# Altium schematic sheet Main.SchDoc
size 431 x 279 mm; Organization: ORGANIZATION; Address1: ADDRESS 1; Address2: ADDRESS 2; Address3: ADDRESS 3; Address4: ADDRESS 4; Revision: -; SheetNumber: 1; SheetTotal: 8; ENG_APP_DATE: --/--/--; DSN_APP_DATE: --/--/--; CHK_APP_DATE: --/--/--
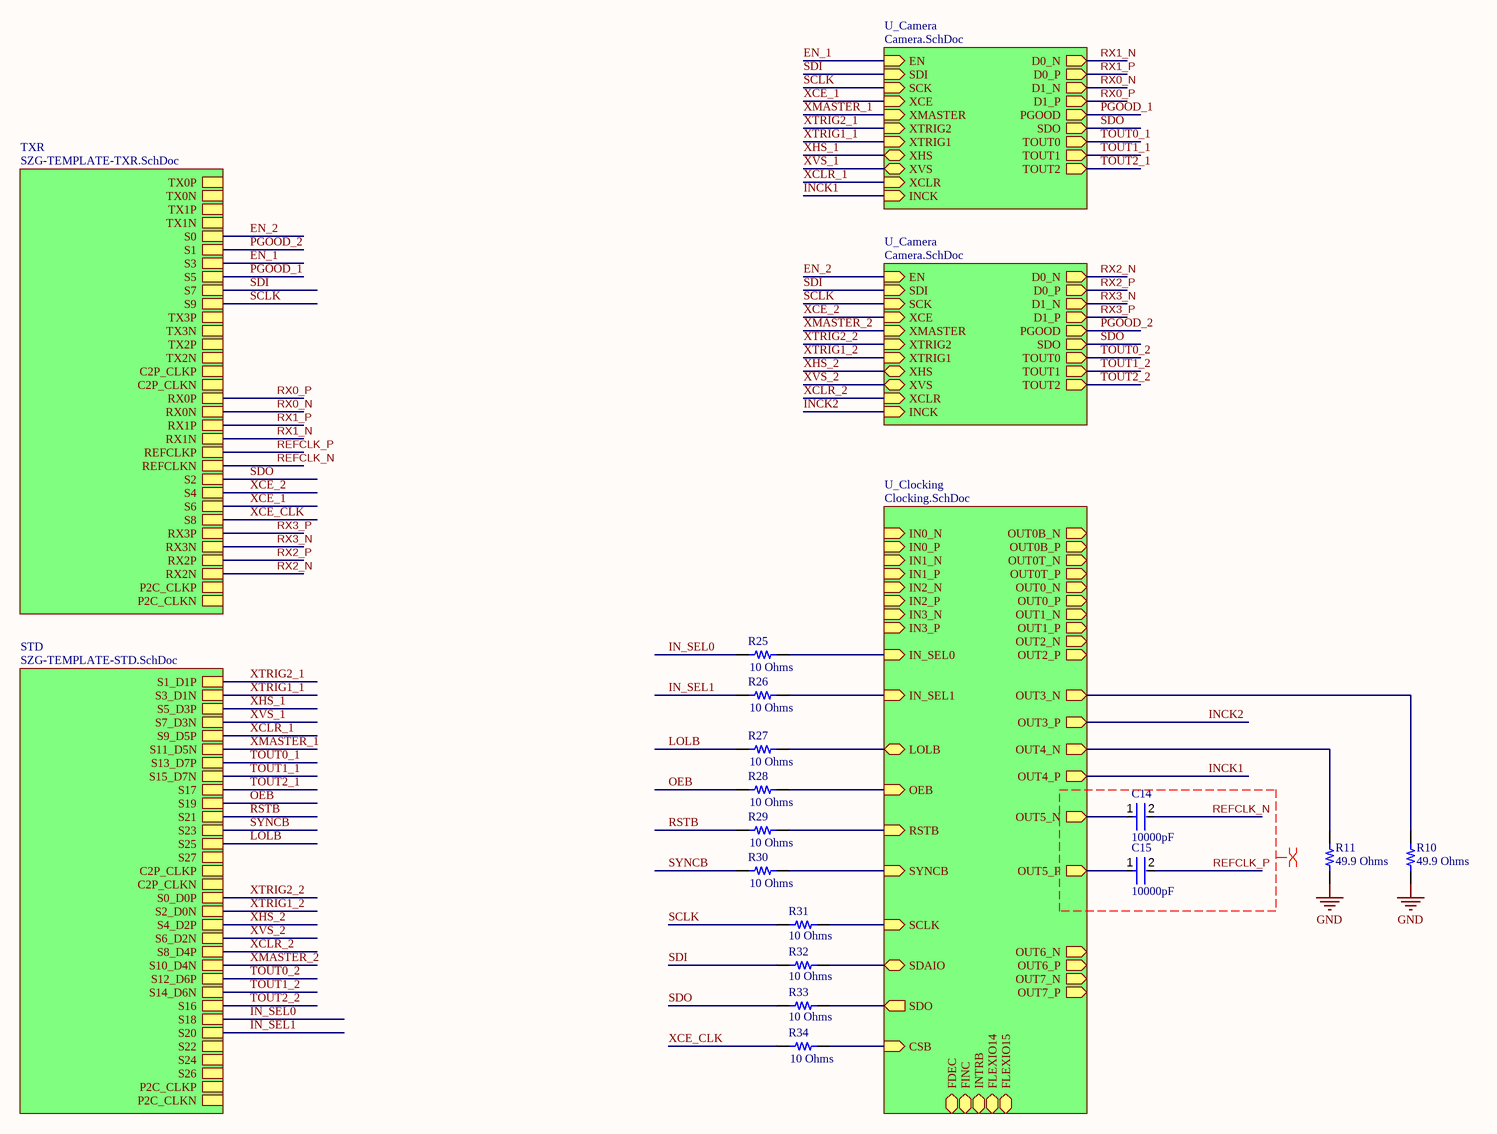
[diagram p0: Main.SchDoc]

## Parts
C14  10000pF  [FP-GRM033-0_03-MFG]
C15  10000pF  [FP-GRM033-0_03-MFG]
R10  49.9 Ohms  [RES 0402_1005]
R11  49.9 Ohms  [RES 0402_1005]
R25  10 Ohms  [RES 0201_0603]
R26  10 Ohms  [RES 0201_0603]
R27  10 Ohms  [RES 0201_0603]
R28  10 Ohms  [RES 0201_0603]
R29  10 Ohms  [RES 0201_0603]
R30  10 Ohms  [RES 0201_0603]
R31  10 Ohms  [RES 0201_0603]
R32  10 Ohms  [RES 0201_0603]
R33  10 Ohms  [RES 0201_0603]
R34  10 Ohms  [RES 0201_0603]

## Sub-sheets
STD = SZG-TEMPLATE-STD.SchDoc: S1_D1P, S3_D1N, S5_D3P, S7_D3N, S9_D5P, S11_D5N, S13_D7P, S15_D7N, S17, S19, S21, S23, S25, S27, C2P_CLKP, C2P_CLKN, S0_D0P, S2_D0N, S4_D2P, S6_D2N, S8_D4P, S10_D4N, S12_D6P, S14_D6N, S16, S18, S20, S22, S24, S26, P2C_CLKP, P2C_CLKN
TXR = SZG-TEMPLATE-TXR.SchDoc: TX0P, TX0N, TX1P, TX1N, S0, S1, S3, S5, S7, S9, TX3P, TX3N, TX2P, TX2N, C2P_CLKP, C2P_CLKN, RX0P, RX0N, RX1P, RX1N, REFCLKP, REFCLKN, S2, S4, S6, S8, RX3P, RX3N, RX2P, RX2N, P2C_CLKP, P2C_CLKN
U_Camera = Camera.SchDoc: D0_N (out), D0_P (out), D1_N (out), D1_P (out), EN (in), PGOOD (out), SDI (in), SCK (in), SDO (out), XCE (in), XMASTER (in), TOUT0 (out), TOUT1 (out), TOUT2 (out), XTRIG2 (in), XTRIG1 (in), XHS (bidir), XVS (bidir), XCLR (in), INCK (in)
U_Camera = Camera.SchDoc: D0_N (out), D0_P (out), D1_N (out), D1_P (out), EN (in), PGOOD (out), SDI (in), SCK (in), SDO (out), XCE (in), XMASTER (in), TOUT0 (out), TOUT1 (out), TOUT2 (out), XTRIG2 (in), XTRIG1 (in), XHS (bidir), XVS (bidir), XCLR (in), INCK (in)
U_Clocking = Clocking.SchDoc: CSB (in), FDEC (bidir), FINC (bidir), FLEXIO14 (bidir), FLEXIO15 (bidir), INTRB (bidir), IN_SEL0 (in), IN_SEL1 (in), LOLB (bidir), OEB (in), RSTB (in), SCLK (in), SDAIO (bidir), SDO (out), SYNCB (in), OUT0B_N (out), OUT0B_P (out), OUT0T_N (out), OUT0T_P (out), OUT0_N (out), OUT0_P (out), OUT1_N (out), OUT1_P (out), OUT2_N (out), OUT2_P (out), OUT3_N (out), OUT3_P (out), OUT4_N (out), OUT4_P (out), OUT5_N (out), OUT5_P (out), OUT6_N (out), OUT6_P (out), OUT7_N (out), OUT7_P (out), IN0_N (in), IN0_P (in), IN1_N (in), IN1_P (in), IN2_N (in), IN2_P (in), IN3_N (in), IN3_P (in)

## Nets
GND: R10.1 R11.1
EN_1: sheet U_Camera/EN, sheet TXR/S3
EN_2: sheet TXR/S0, sheet U_Camera/EN
IN_SEL0: R25.1 ; sheet STD/S18
IN_SEL1: R26.1 ; sheet STD/S20
INCK1: sheet U_Camera/INCK, sheet U_Clocking/OUT4_P
INCK2: sheet U_Clocking/OUT3_P, sheet U_Camera/INCK
LOLB: R27.1 ; sheet STD/S25
OEB: R28.1 ; sheet STD/S19
PGOOD_1: sheet U_Camera/PGOOD, sheet TXR/S5
PGOOD_2: sheet TXR/S1, sheet U_Camera/PGOOD
REFCLK_N: C14.2 ; sheet TXR/REFCLKN
REFCLK_P: C15.2 ; sheet TXR/REFCLKP
RSTB: R29.1 ; sheet STD/S21
RX0_N: sheet U_Camera/D1_N, sheet TXR/RX0N
RX0_P: sheet U_Camera/D1_P, sheet TXR/RX0P
RX1_N: sheet U_Camera/D0_N, sheet TXR/RX1N
RX1_P: sheet U_Camera/D0_P, sheet TXR/RX1P
RX2_N: sheet TXR/RX2N, sheet U_Camera/D0_N
RX2_P: sheet TXR/RX2P, sheet U_Camera/D0_P
RX3_N: sheet TXR/RX3N, sheet U_Camera/D1_N
RX3_P: sheet TXR/RX3P, sheet U_Camera/D1_P
SCLK: R31.1 ; sheet U_Camera/SCK, sheet TXR/S9, sheet U_Camera/SCK
SDI: R32.1 ; sheet U_Camera/SDI, sheet TXR/S7, sheet U_Camera/SDI
SDO: R33.1 ; sheet U_Camera/SDO, sheet TXR/S2, sheet U_Camera/SDO
SYNCB: R30.1 ; sheet STD/S23
TOUT0_1: sheet U_Camera/TOUT0, sheet STD/S13_D7P
TOUT0_2: sheet STD/S12_D6P, sheet U_Camera/TOUT0
TOUT1_1: sheet U_Camera/TOUT1, sheet STD/S15_D7N
TOUT1_2: sheet STD/S14_D6N, sheet U_Camera/TOUT1
TOUT2_1: sheet U_Camera/TOUT2, sheet STD/S17
TOUT2_2: sheet STD/S16, sheet U_Camera/TOUT2
XCE_1: sheet U_Camera/XCE, sheet TXR/S6
XCE_2: sheet TXR/S4, sheet U_Camera/XCE
XCE_CLK: R34.1 ; sheet TXR/S8
XCLR_1: sheet U_Camera/XCLR, sheet STD/S9_D5P
XCLR_2: sheet STD/S8_D4P, sheet U_Camera/XCLR
XHS_1: sheet U_Camera/XHS, sheet STD/S5_D3P
XHS_2: sheet STD/S4_D2P, sheet U_Camera/XHS
XMASTER_1: sheet U_Camera/XMASTER, sheet STD/S11_D5N
XMASTER_2: sheet STD/S10_D4N, sheet U_Camera/XMASTER
XTRIG1_1: sheet U_Camera/XTRIG1, sheet STD/S3_D1N
XTRIG1_2: sheet STD/S2_D0N, sheet U_Camera/XTRIG1
XTRIG2_1: sheet U_Camera/XTRIG2, sheet STD/S1_D1P
XTRIG2_2: sheet STD/S0_D0P, sheet U_Camera/XTRIG2
XVS_1: sheet U_Camera/XVS, sheet STD/S7_D3N
XVS_2: sheet STD/S6_D2N, sheet U_Camera/XVS
NetC14_1: C14.1 ; sheet U_Clocking/OUT5_N
NetC15_1: C15.1 ; sheet U_Clocking/OUT5_P
NetR10_2: R10.2 ; sheet U_Clocking/OUT3_N
NetR11_2: R11.2 ; sheet U_Clocking/OUT4_N
NetR25_2: R25.2 ; sheet U_Clocking/IN_SEL0
NetR26_2: R26.2 ; sheet U_Clocking/IN_SEL1
NetR27_2: R27.2 ; sheet U_Clocking/LOLB
NetR28_2: R28.2 ; sheet U_Clocking/OEB
NetR29_2: R29.2 ; sheet U_Clocking/RSTB
NetR30_2: R30.2 ; sheet U_Clocking/SYNCB
NetR31_2: R31.2 ; sheet U_Clocking/SCLK
NetR32_2: R32.2 ; sheet U_Clocking/SDAIO
NetR33_2: R33.2 ; sheet U_Clocking/SDO
NetR34_2: R34.2 ; sheet U_Clocking/CSB

## Layout directives
differential pair; net class REFCLK; differential pair class REFCLK: REFCLK_N, REFCLK_P

## Notes on the sheet
- DWG. NO.
- REV.
- SHT.
- REVISION
- DESCRIPTION
- DATE
- APPROVED
- ENG:
- APPROVALS
- PROJECT
- DSN:
- CHK:
- REFERENCE DOCUMENTS
- PROJECT REVISION:
- TITLE
- SimulaVR
- DOCUMENT REVISION:
- DESIGN ITEM:
- BOM:
- FAB DWG:
- PCB DWG:
- ASSY DWG:
- SCALE:
- SIZE
- B
- CAGE CODE
- FILE NAME
- DWG NO.
- SHEET
- OF
- REV

## Library data of the parts
C14 C15 = CMP-001-00084-1: CAP CER 10000PF 25V X5R 0201
R10 R11 = ERJ-2RKF49R9X: RES SMD 49.9 OHM 1% 1/10W 0402; Manufacturer: Panasonic Electronic Components; Power (Watts): 0.1W, 1/10W; Temperature Coefficient: ±100ppm/°C; Part Number: ERJ-2RKF49R9X; Value: 49.9 Ohms; ComponentLink1Description: Datasheet; ComponentLink1URL: https://industrial.panasonic.com/cdbs/www-data/pdf/RDA0000/AOA0000C304.pdf; ComponentLink2Description: DigiKey Link; ComponentLink2URL: https://www.digikey.com/en/products/detail/panasonic-electronic-components/ERJ-2RKF49R9X/192382; Composition: Thick Film; Device Package: 0402 (1005 Metric); Features: Automotive AEC-Q200; Height - Seated (Max): 0.016" (0.40mm); LastUpdated: 8/11/2022 9:07:22 AM; Lifecycle Status: Active; Minimum Order: 1; Number of Terminations: 2; Operating Temperature: -55°C ~ 155°C; Package / Case: 0402 (1005 Metric); Packaging: CutTape; PartId: 17623; Part Status: Active; Price: 0.01; Ratings: AEC-Q200; Resistance: 49.9 Ohms; Series: ERJ-2RK; Size / Dimension: 0.039" L x 0.020" W (1.00mm x 0.50mm); Supplier 1: DigiKey; Supplier Part Number 1: P49.9LCT-ND; Supplier Device Package: 0402; Tolerance: ±1%
R25-R34 = CRG0201F10R: RES SMD 10 OHM 1% 1/20W 0201; Manufacturer: TE Connectivity Passive Product; Power (Watts): 0.05W, 1/20W; Temperature Coefficient: ±400ppm/°C; Part Number: CRG0201F10R; Value: 10 Ohms; ComponentLink1Description: Datasheet; ComponentLink1URL: https://www.te.com/commerce/DocumentDelivery/DDEController?Action=srchrtrv&DocNm=1773204&DocType=DS&DocLang=English; ComponentLink2Description: DigiKey Link; ComponentLink2URL: https://www.digikey.com/en/products/detail/te-connectivity-passive-product/CRG0201F10R/4489648; Composition: Thick Film; Device Package: 0201 (0603 Metric); Height - Seated (Max): 0.010" (0.26mm); LastUpdated: 8/11/2022 9:03:27 AM; Lifecycle Status: Active; Minimum Order: 1; Number of Terminations: 2; Operating Temperature: -55°C ~ 155°C; Package / Case: 0201 (0603 Metric); Packaging: TapeAndReel; PartId: 3; Part Status: Active; Price: 0.03; Resistance: 10 Ohms; Series: CRG, Neohm; Size / Dimension: 0.024" L x 0.012" W (0.60mm x 0.30mm); Supplier 1: DigiKey; Supplier Part Number 1: A129573CT-ND; Supplier Device Package: 0201; Tolerance: ±1%